# EAGLE design PIR_LED_ctrl (EAGLE 7.7.0)
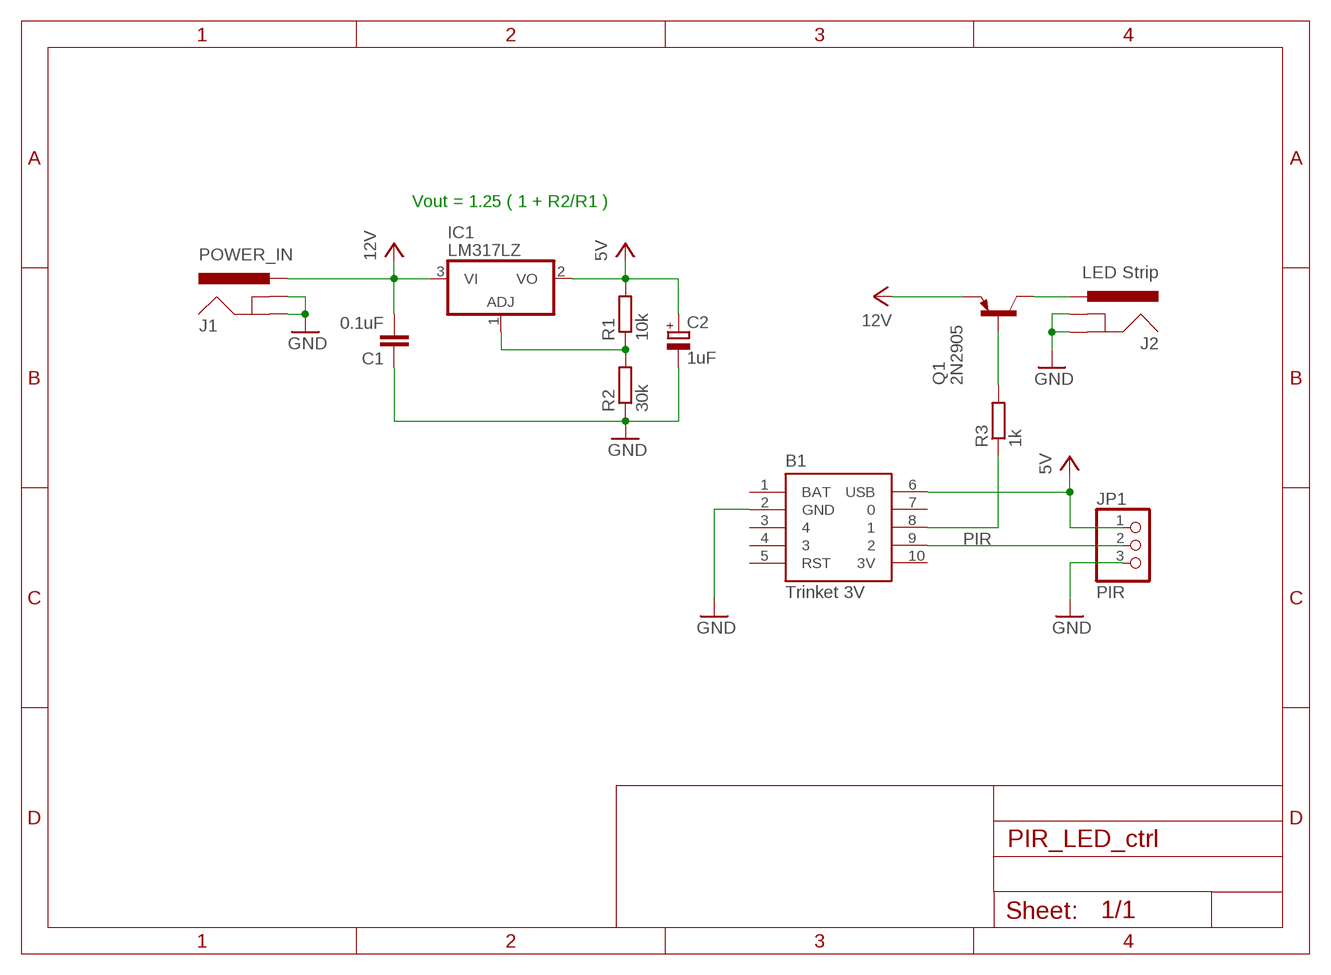
[diagram p0: schematic, sheet 1]

## Parts
B1  Trinket 3V  TRINKET_3V  [TRINKET_3V]
C1  0.1uF  C-EU025-025X050  [C025-025X050]
C2  1uF  CPOL-EUE5-6  [E5-6]
IC1  LM317LZ  [TO92]
J1  POWER_IN  POWER_JACKPTH  [POWER_JACK_PTH]
J2  LED Strip  POWER_JACKPTH  [POWER_JACK_PTH]
JP1  PIR  HEADER-1X3ROUND  [1X03_ROUND]
Q1  2N2905  2N2905-PNP-TO39-EBC  [TO39]
R1  10k  R-EU_0207/10  [0207/10]
R2  30k  R-EU_0207/10  [0207/10]
R3  1k  R-EU_0207/10  [0207/10]

## Nets
5V: B1.6(USB) C2.+ IC1.2(VO) JP1.1 R1.2
12V: C1.2 IC1.3(VI) J1.PWR Q1.1(E)
GND: B1.2(GND) C1.1 C2.- J1.GND J1.GNDBREAK J2.GND J2.GNDBREAK JP1.3 R2.1
N$1: IC1.1(ADJ) R1.1 R2.2
N$2: J2.PWR Q1.3(C)
N$3: B1.8 R3.1
N$4: Q1.2(B) R3.2
PIR: B1.9 JP1.2
Unconnected: B1.1(BAT) B1.3 B1.4 B1.5(RST) B1.7 B1.10(3V)

## Notes on the sheet
- Vout = 1.25 ( 1 + R2/R1 )

## Library data of the parts
B1 = pero_library:TRINKET_3V: Adafruit Trinket 3V Component for the Trinket 3V
C1 = rcl:C-EU: CAPACITOR, European symbol
C2 = rcl:CPOL-EU: POLARIZED CAPACITOR, European symbol
IC1 = linear:*317: Positive VOLTAGE REGULATOR
J1 J2 = SparkFun-Connectors:POWER_JACK: Power Jack This is the standard 5.5mm barrel jack for power. The PTH is the most common, proven, reliable, footprint. The Slot footprint only works if the mill layer is transmitted to the PCB fab house so be warned. Mating wall wart : TOL-00298 (and others); PROD_ID: CONN-08197
JP1 = microbuilder:HEADER-1X3: PIN HEADER
Q1 = transistor:*-PNP-: PNP Transistror
R1-R3 = rcl:R-EU_: RESISTOR, European symbol

## Board
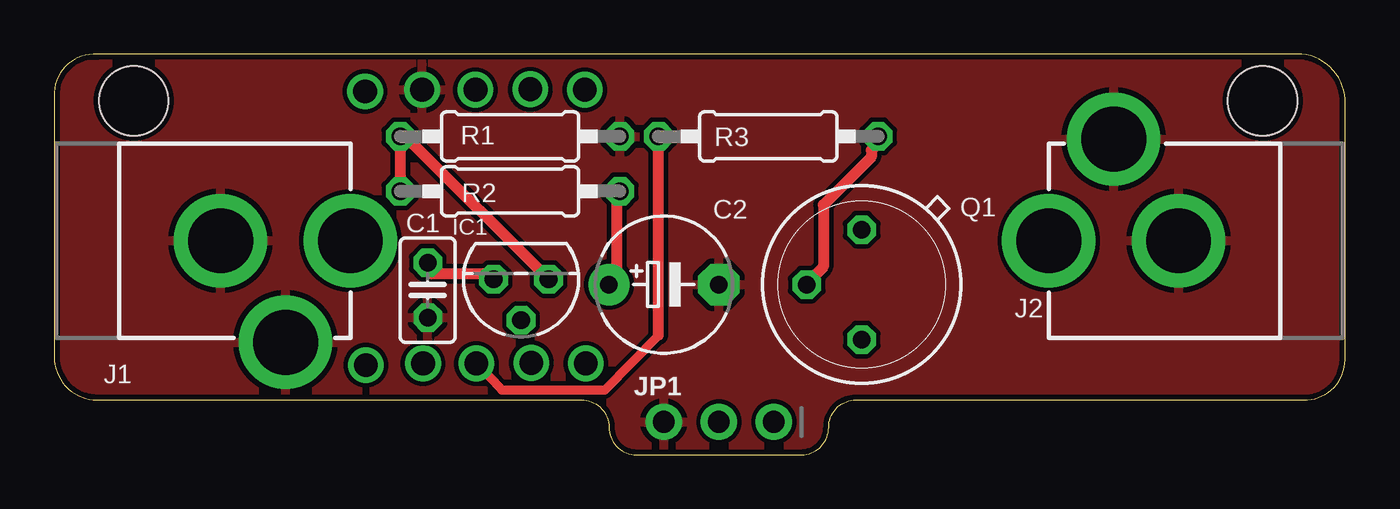
[diagram p1: board, top side]
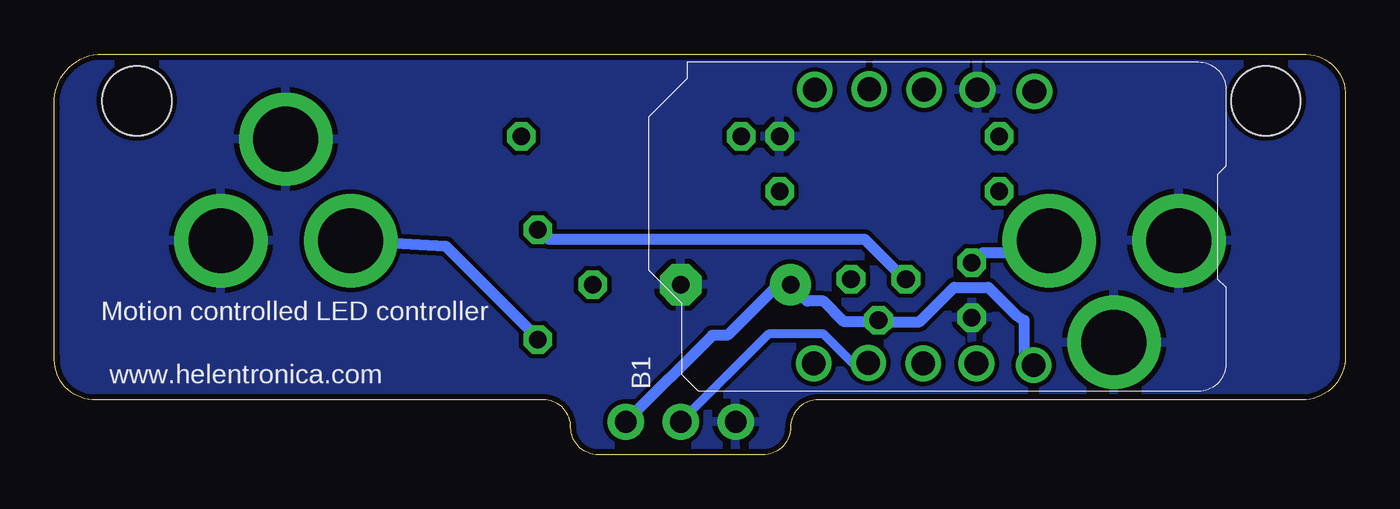
[diagram p2: board, bottom side, seen from below]

Size 59.7 x 18.54 mm. Coordinates in mm from the lower left corner, seen from the top.
Outline: 0,16.79 0,4.54 arc90 2,2.54 24.38,2.54 arc-90 25.65,1.27 arc90 26.92,0 34.54,0 arc90 35.81,1.27 arc-90 37.08,2.54 57.94,2.54 arc90 59.69,4.57 59.69,16.03 arc90 57.69,18.54 2,18.53 arc90 0,16.79
Copper layers (1*16): Top 0.035mm / dielectric 1.5mm / Bottom 0.035mm
Design rules "default *": minimum track width 10mil, minimum drill 24mil, track to track 8mil, track to pad 8mil, pad to pad 8mil, via to via 8mil, smd to smd 8mil, copper to edge 10mil, drill to drill 8mil, minimum pad ring 10mil, minimum via ring 8mil, stop-mask expansion 4mil, vias tented up to drill 0mil, thermal gap 10mil
Holes 3.2 mm at 55.88,16.38 3.68,16.38

### Footprints (pad centres in the part's own frame; a part is rotated, then mirrored left to right if it is on the bottom)
TRINKET_3V = drill 1.1: 1 -5.893,4.674; 2 -5.969,2.032; 3 -5.969,-0.432; 4 -5.994,-2.972; 5 -5.969,-5.486; 6 6.769,4.63; 7 6.693,1.989; 8 6.693,-0.475; 9 6.668,-3.015; 10 6.693,-5.53
C025-025X050 = drill 0.813 octagon: 1 -1.27,0; 2 1.27,0
E5-6 = drill 0.813 pad 1.905: + -2.54,0 | drill 0.813 pad 1.905 octagon: - 2.54,0
TO92 = drill 0.813 octagon: 1 -1.27,0; 2 0,1.905; 3 1.27,0
POWER_JACK_PTH = drill 2.997 pad 4.318: GND 0,7.7; GNDBREAK 4.7,10.7; PWR 0,13.7
1X03_ROUND = drill 1 pad 1.676: 1 -2.54,0; 2 0,0; 3 2.54,0
TO39 = drill 0.813 octagon: 1 0,-2.54; 2 2.54,0; 3 0,2.54
0207/10 = drill 0.813 octagon: 1 -5.08,0; 2 5.08,0

### Placement (x,y rotation side)
B1  19.05,10.92 270 bottom
C1  17.27,7.62 90 top
C2  28.19,7.87 0 top
IC1  21.59,8.13 180 top
J1  0,9.91 270 top
J2  59.69,9.91 90 top
JP1  30.73,1.52 180 top
Q1  37.34,7.87 180 top
R1  21.08,12.19 0 top
R2  21.08,14.73 180 top
R3  33.02,14.73 0 top
U$1  [A5L-LOC]  -64.77,-58.93 0 top  (outside the outline)

### Tracks (layer width: path | path; a pad name or v marks a point on that pad's centre or on a via)
5V
  Top 0.508: R1.2 26.04,12.19 26.04,8.38 25.72,8.07 C2.+
  Bottom 0.508: 25.4,7.75 C2.+ | 21.59,6.16 19.68,6.16 18.1,7.75 16.51,7.75 15.24,6.48 14.86,6.22 14.86,4.76 B1.6 | 21.59,6.16 IC1.2 | C2.+ 25.72,7.75 26.35,7.75 28.57,5.53 29.27,5.53 JP1.1 | C2.+ 24.89,7.11 24.13,7.11 23.18,6.16 21.59,6.16
12V
  Top 0.508: IC1.3 20.32,8.38 17.46,8.38 17.46,8.7 C1.2
  Bottom 0.508: C1.2 16.83,9.34 14.29,9.34 13.97,9.65 J1.PWR | Q1.1 37.15,10.29 36.83,9.97 22.22,9.97 20.64,8.38 20.32,8.38 IC1.3
GND
  pour Bottom: 2.54,18.54 57.69,18.54 arc-90 59.69,17.05 59.69,0.76 arc-90 58.67,0 2.79,0 arc-90 0.25,3.81 0,14.73 arc-90
  pour Top: 2.54,18.54 57.15,18.54 arc-90 59.69,14.73 59.94,2.54 arc-90 58.67,0 2.79,0 arc-90 0.25,2.54 0,14.73 arc-90
N$1
  Top 0.508: R1.1 16.19,12.19 16,12.26 16,14.1 15.94,14.67 16.19,14.73 R2.2 15.88,14.73 15.88,15.05 16.45,14.54 IC1.1
N$2
  Bottom 0.508: J2.PWR 41.59,9.65 37.47,5.53 Q1.3
N$3
  Top 0.406: B1.8 20.7,3 25.46,3 27.94,5.53
  Top 0.508: 27.94,5.53 R3.1
N$4
  Top 0.508: R3.2 38.1,14.41 37.78,14.1 37.78,13.78 35.56,11.56 35.56,8.7 34.92,8.07 Q1.2
PIR
  Bottom 0.406: B1.9 22.8,4.25 24.13,5.59 26.67,5.59 JP1.2

### Text on the board
bNames: Motion controlled LED controller | www.helentronica.com
Document: Controller board for the motion controlled / LED strip.
tDocu: Pero 2017 | www.helentronica.com